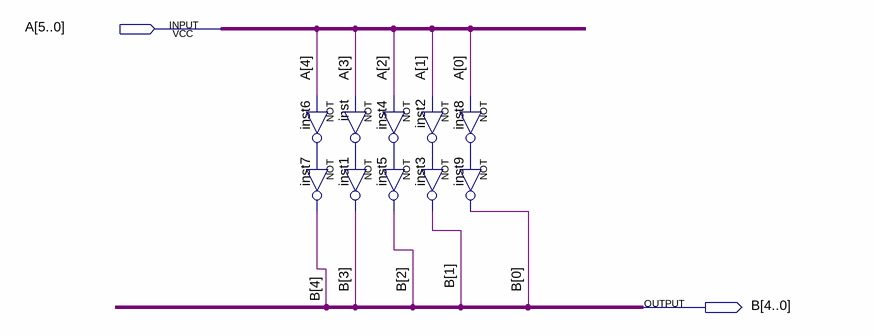
[diagram p0: schematic sheet]
// Quartus schematic remove_1bit.bdf as structural Verilog: 10 symbols, 2 pins
module remove_1bit (
  input  [5:0] A,
  output [4:0] B
);

  wire inst2_out, inst4_out, inst6_out, inst8_out, inst_out;

  not inst6 (inst6_out, A[4]);
  not inst7 (B[4], inst6_out);
  not inst (inst_out, A[3]);
  not inst4 (inst4_out, A[2]);
  not inst1 (B[3], inst_out);
  not inst5 (B[2], inst4_out);
  not inst2 (inst2_out, A[1]);
  not inst8 (inst8_out, A[0]);
  not inst3 (B[1], inst2_out);
  not inst9 (B[0], inst8_out);
endmodule
